# EAGLE design CCM_0005 (EAGLE 6.5.0)
Unipolar (6 wire) stepper motor driver
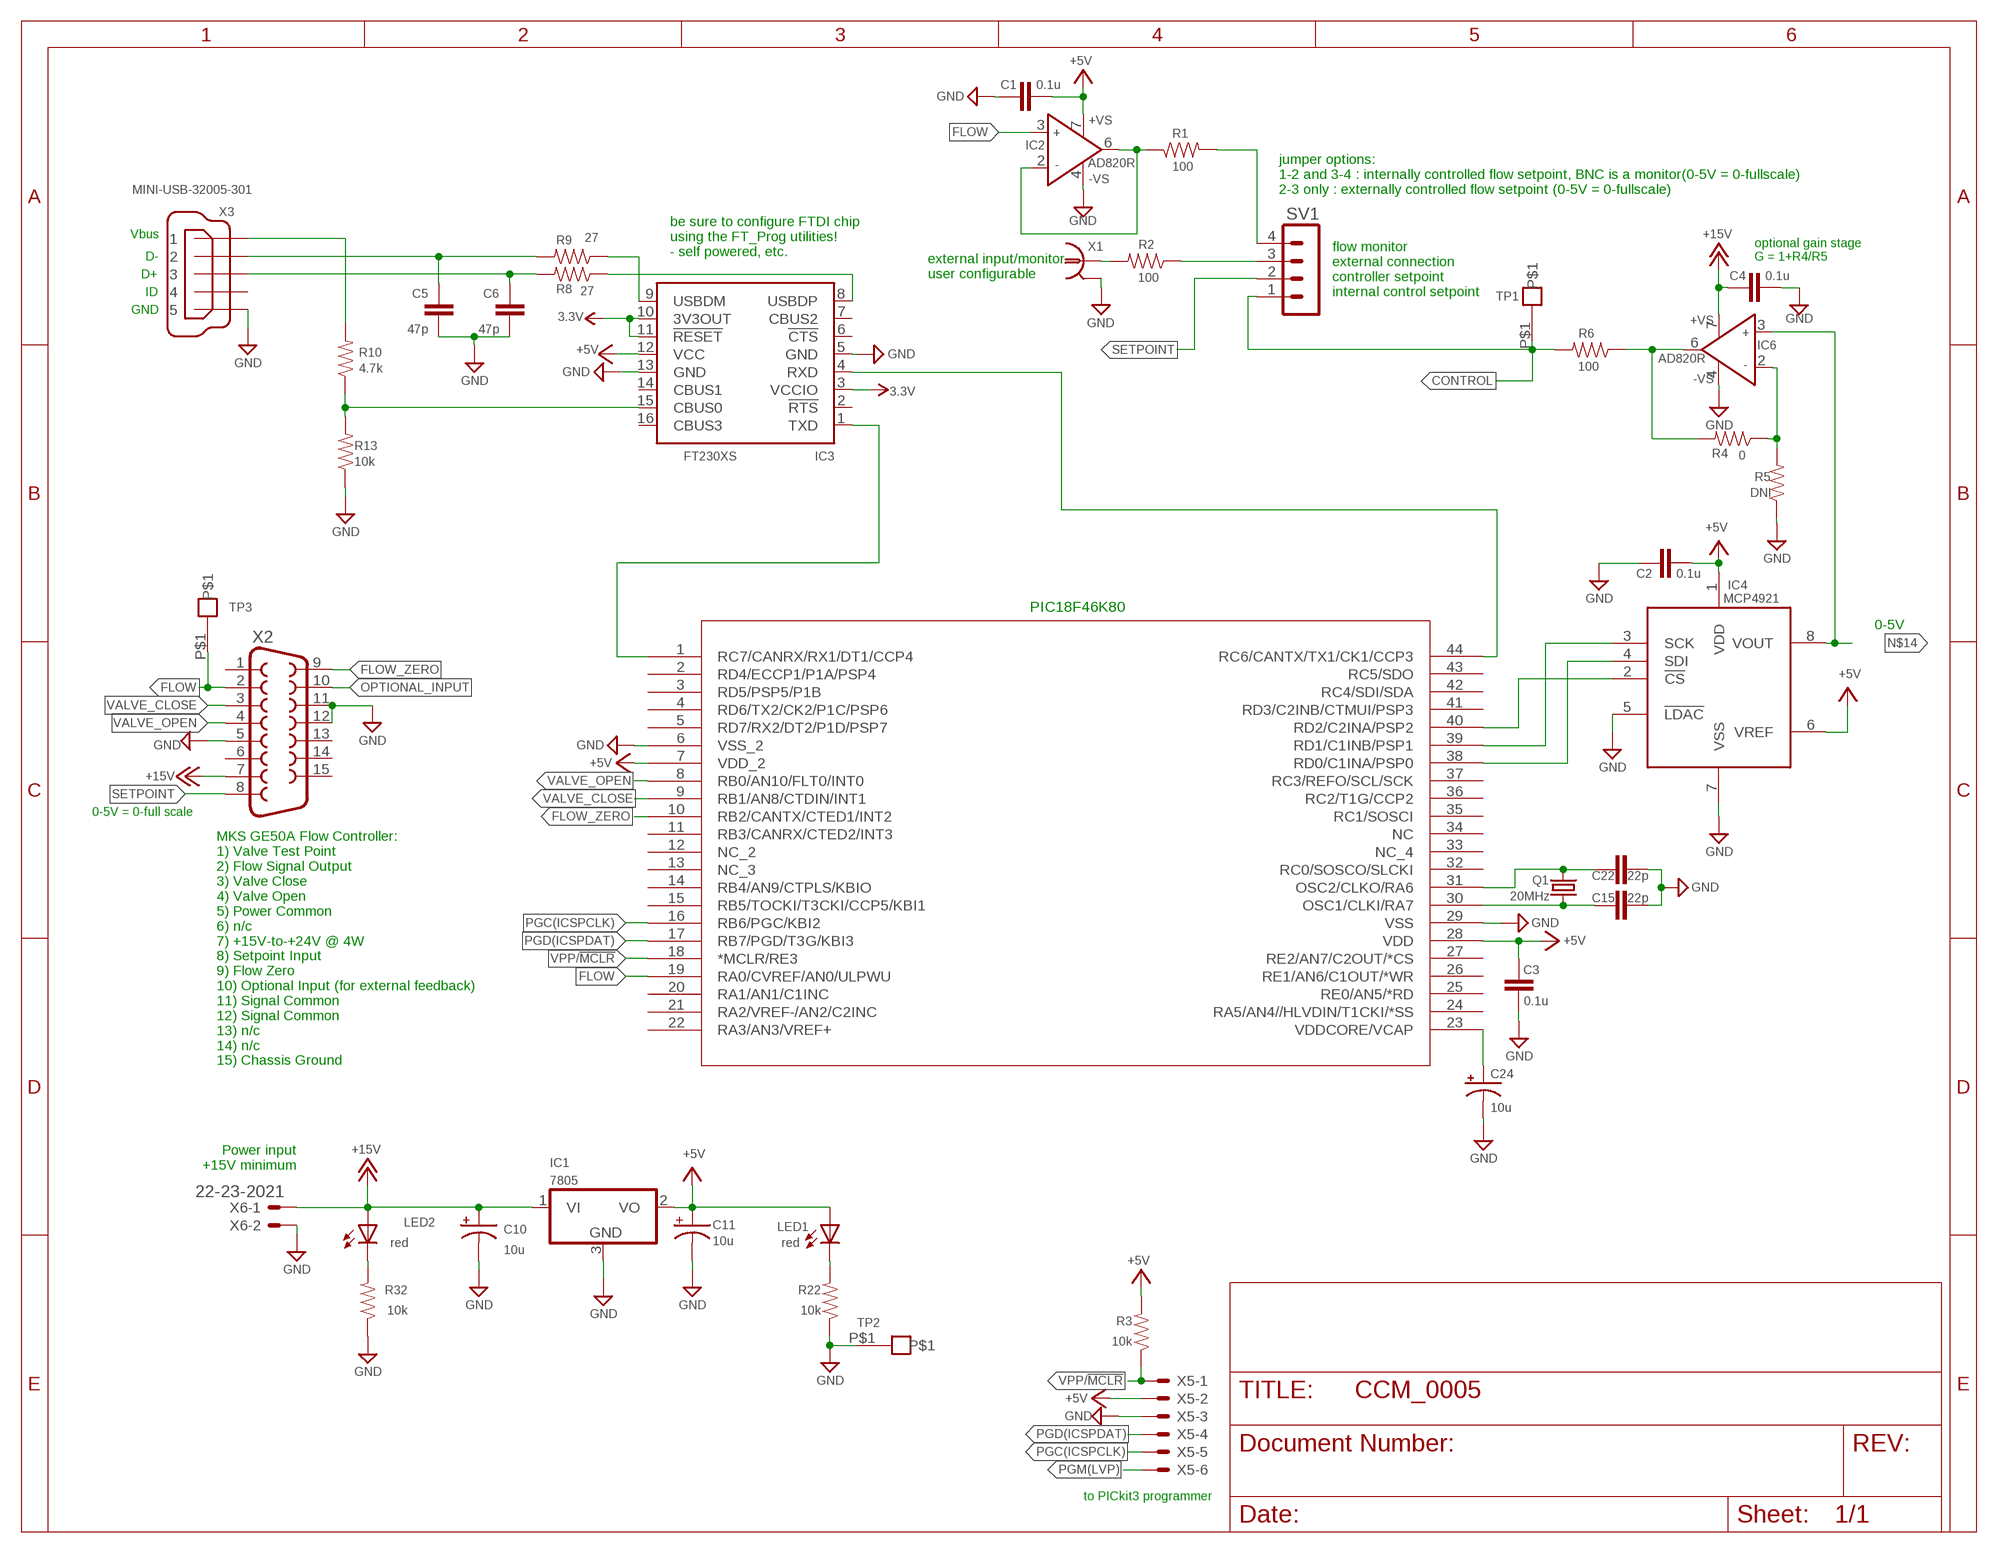
[diagram p0: schematic, sheet 1]

## Parts
C1  0.1u  CAP0603-CAP  [0603-CAP]
C2  0.1u  CAP0603-CAP  [0603-CAP]
C3  0.1u  CAP0603-CAP  [0603-CAP]
C4  0.1u  CAP0603-CAP  [0603-CAP]
C5  47p  CAP0603-CAP  [0603-CAP]
C6  47p  CAP0603-CAP  [0603-CAP]
C10  10u  CAP_POL1206  [EIA3216]
C11  10u  CAP_POL1206  [EIA3216]
C15  22p  CAP0603-CAP  [0603-CAP]
C22  22p  CAP0603-CAP  [0603-CAP]
C24  10u  CAP_POL1206  [EIA3216]
IC1  7805  7824DT  [TO252]
IC2  AD820R  [SO8]
IC3  FT230XS  [SSOP16]
IC4  MCP4921  [SO08]
IC5  PIC18F46K80  [TQFP44_MC]
IC6  AD820R  [SO8]
LED1  red  LEDCHIPLED_0603  [CHIPLED_0603]
LED2  red  LEDCHIPLED_0603  [CHIPLED_0603]
Q1  20MHz  CRYSTALTC26V  [TC26V]
R1  100  RESISTOR0603-RES  [0603-RES]
R2  100  RESISTOR0603-RES  [0603-RES]
R3  10k  RESISTOR0603-RES  [0603-RES]
R4  0  RESISTOR0603-RES  [0603-RES]
R5  DNI  RESISTOR0603-RES  [0603-RES]
R6  100  RESISTOR0603-RES  [0603-RES]
R8  27  RESISTOR0603-RES  [0603-RES]
R9  27  RESISTOR0603-RES  [0603-RES]
R10  4.7k  RESISTOR0603-RES  [0603-RES]
R13  10k  RESISTOR0603-RES  [0603-RES]
R22  10k  RESISTOR0603-RES  [0603-RES]
R32  10k  RESISTOR0603-RES  [0603-RES]
SV1  MA04-1  [MA04-1]
TP1  control  TESTPOINT  [TESTPOINT]
TP2  TESTPOINT  [TESTPOINT]
TP3  control  TESTPOINT  [TESTPOINT]
X1  1-227161-0  [AMP_227161]
X2  F15HP  [F15HP]
X3  MINI-USB-32005-301  [32005-301]
X5  22-23-2061  [22-23-2061]
X6  22-23-2021  [22-23-2021]

## Nets
3.3V: IC3.3(VCCIO) IC3.10(3V3OUT) IC3.11(!RESET)
+5V: C1.1 C2.1 C3.1 C11.A(+) IC1.2(VO) IC2.7(+VS) IC3.12(VCC) IC4.1(VDD) IC4.6(VREF) IC5.7(VDD_2) IC5.28(VDD) LED1.A R3.2 X5.2
+15V: C4.2 C10.A(+) IC1.1(VI) IC6.7(+VS) LED2.A X2.7 X6.1
CONTROL: R6.2 SV1.1 TP1.P$1
D+: C6.1 R8.2 X3.3
D-: C5.1 R9.2 X3.2
FLOW: IC2.3(IN+) IC5.19(RA0/CVREF/AN0/ULPWU) TP3.P$1 X2.2
FLOW_ZERO: IC5.10(RB2/CANTX/CTED1/INT2) X2.9
GND: C1.2 C2.2 C3.2 C4.1 C5.2 C6.2 C10.C(-) C11.C(-) C15.1 C22.1 C24.C(-) IC1.3(GND) IC2.4(-VS) IC3.5(GND) IC3.13(GND) IC4.5(!LDAC) IC4.7(VSS) IC5.6(VSS_2) IC5.29(VSS) IC6.4(-VS) R5.1 R13.1 R22.1 R32.1 TP2.P$1 X1.2 X2.5 X2.11 X2.12 X3.5 X5.3 X6.2
LED1: LED1.C R22.2
LED5: LED2.C R32.2
N12: IC6.6(OUT) R4.2 R6.1
N$1: R2.2 X1.1
N$2: R1.2 SV1.4
N$3: IC2.2(IN-) IC2.6(OUT) R1.1
N$4: C15.2 IC5.30(OSC1/CLKI/RA7) Q1.1
N$5: IC3.1(TXD) IC5.1(RC7/CANRX/RX1/DT1/CCP4)
N$6: IC3.9(USBDM) R9.1
N$7: IC4.2(!CS) IC5.40(RD2/C2INA/PSP2)
N$8: IC3.8(USBDP) R8.1
N$9: R2.1 SV1.3
N$10: C22.2 IC5.31(OSC2/CLKO/RA6) Q1.2
N$11: IC4.3(SCK) IC5.39(RD1/C1INB/PSP1)
N$12: C24.A(+) IC5.23(VDDCORE/VCAP)
N$13: IC3.15(CBUS0) R10.1 R13.2
N$14: IC4.8(VOUT) IC6.3(IN+)
N$15: IC6.2(IN-) R4.1 R5.2
N$16: IC4.4(SDI) IC5.38(RD0/C1INA/PSP0)
OPTIONAL_INPUT: X2.10
PGC(ICSPCLK): IC5.16(RB6/PGC/KBI2) X5.5
PGD(ICSPDAT): IC5.17(RB7/PGD/T3G/KBI3) X5.4
PGM(LVP): X5.6
SETPOINT: SV1.2 X2.8
TX1: IC3.4(RXD) IC5.44(RC6/CANTX/TX1/CK1/CCP3)
VALVE_CLOSE: IC5.9(RB1/AN8/CTDIN/INT1) X2.3
VALVE_OPEN: IC5.8(RB0/AN10/FLT0/INT0) X2.4
VBUS: R10.2 X3.1
VPP/!MCLR: IC5.18(*MCLR/RE3) R3.1 X5.1
Unconnected: IC3.2(!RTS) IC3.6(!CTS) IC3.7(CBUS2) IC3.14(CBUS1) IC3.16(CBUS3) IC5.2(RD4/ECCP1/P1A/PSP4) IC5.3(RD5/PSP5/P1B) IC5.4(RD6/TX2/CK2/P1C/PSP6) IC5.5(RD7/RX2/DT2/P1D/PSP7) IC5.11(RB3/CANRX/CTED2/INT3) IC5.12(NC_2) IC5.13(NC_3) IC5.14(RB4/AN9/CTPLS/KBIO) IC5.15(RB5/TOCKI/T3CKI/CCP5/KBI1) IC5.20(RA1/AN1/C1INC) IC5.21(RA2/VREF-/AN2/C2INC) IC5.22(RA3/AN3/VREF+) IC5.24(RA5/AN4//HLVDIN/T1CKI/*SS) IC5.25(RE0/AN5/*RD) IC5.26(RE1/AN6/C1OUT/*WR) IC5.27(RE2/AN7/C2OUT/*CS) IC5.32(RC0/SOSCO/SLCKI) IC5.33(NC_4) IC5.34(NC) IC5.35(RC1/SOSCI) IC5.36(RC2/T1G/CCP2) IC5.37(RC3/REFO/SCL/SCK) IC5.41(RD3/C2INB/CTMUI/PSP3) IC5.42(RC4/SDI/SDA) IC5.43(RC5/SDO) X2.1 X2.6 X2.13 X2.14 X2.15 X3.4

## Notes on the sheet
- jumper options:
  1-2 and 3-4 : internally controlled flow setpoint, BNC is a monitor(0-5V = 0-fullscale)
  2-3 only : externally controlled flow setpoint (0-5V = 0-fullscale)
- Vbus
- be sure to configure FTDI chip
  using the FT_Prog utilities!
  - self powered, etc.
- D-
- optional gain stage
  G = 1+R4/R5
- D+
- external input/monitor
  user configurable
- ID
- flow monitor
  external connection
  controller setpoint
  internal control setpoint
- GND
- PIC18F46K80
- 0-5V
- 0-5V = 0-full scale
- MKS GE50A Flow Controller:
  1) Valve Test Point
  2) Flow Signal Output
  3) Valve Close
  4) Valve Open
  5) Power Common
  6) n/c
  7) +15V-to-+24V @ 4W
  8) Setpoint Input
  9) Flow Zero
  10) Optional Input (for external feedback)
  11) Signal Common
  12) Signal Common
  13) n/c
  14) n/c
  15) Chassis Ground
- Power input
  +15V minimum
- to PICkit3 programmer

## Library data of the parts
C1-C6 C15 C22 = SparkFun:CAP: Capacitor Standard 0603 ceramic capacitor, and 0.1" leaded capacitor.
C10 C11 C24 = SparkFun:CAP_POL: Capacitor Polarized These are standard SMD and PTH capacitors. Normally 10uF, 47uF, and 100uF in electrolytic and tantalum varieties. Always verify the external diameter of the through hole cap, it varies with capacity, voltage, and manufacturer. The EIA devices should be standard.
IC1 = linear:78*: Positive VOLTAGE REGULATOR Source: http://cache.national.com/ds/LM/LM78L05.pdf http://www.fairchildsemi.com/ds/LM/LM7805.pdf
IC2 IC6 = analog-devices:AD820: Single-Supply, Rail-to-Rail, Low Power, FET Input Op Amp Source: http://www.analog.com/static/imported-files/data_sheets/AD820.pdf; OC_FARNELL: 1838867; OC_NEWARK: unknown
IC3 = ftdichip:FT230X: USB to BASIC UART IC Auto generated by make-symbol-device-package-bsdl.ulp Rev. 43 Source: Data sheet <http://www.ftdichip.com/Support/Documents/DataSheets/ICs/DS_FT230X.pdf>
IC4 = ic:MCP4921
IC5 = Fitch:PIC18F46K80
LED1 LED2 = led:LED: LED OSRAM: - CHIPLED LG R971, LG N971, LY N971, LG Q971, LY Q971, LO R971, LY R971 LH N974, LH R974 LS Q976, LO Q976, LY Q976 LO Q996 - Hyper CHIPLED LW Q18S LB Q993, LB Q99A, LB R99A - SideLED LS A670, LO A670, LY A670, LG A670, LP A670 LB A673, LV A673, LT A673, LW A673 LH A674 LY A675 LS A676, LA A676, LO A676, LY A676, LW A676 LS A679, LY A679, LG A679 - Hyper Micro SIDELED® LS Y876, LA Y876, LO Y876, LY Y876 LT Y87S - SmartLED LW L88C, LW L88S LB L89C, LB L89S, LG L890 LS L89K, LO L89K, LY L89K LS L896, LA L896, LO L896, LY L896 - TOPLED LS T670, LO T670, LY T670, LG T670, LP T670 LSG T670, LSP T670, LSY T670, LOP T670, LYG T670 LG T671, LOG T671, LSG T671 LB T673, LV T673, LT T673, LW T673 LH T674 LS T676, LA T676, LO T676, LY T676, LB T676, LH T676, LSB T676, LW T676 LB T67C, LV T67C, LT T67C, LS T67K, LO T67K, LY T67K, LW E67C LS E67B, LA E67B, LO E67B, LY E67B, LB E67C, LV E67C, LT E67C LW T67C LS T679, LY T679, LG T679 LS T770, LO T770, LY T770, LG T770, LP T770 LB T773, LV T773, LT T773, LW T773 LH T774 LS E675, LA E675, LY E675, LS T675 LS T776, LA T776, LO T776, LY T776, LB T776 LHGB T686 LT T68C, LB T68C - Hyper Mini TOPLED® LB M676 - Mini TOPLED Santana® LG M470 LS M47K, LO M47K, LY M47K Source: http://www.osram.convergy.de LUXEON: - LUMILED® LXK2-PW12-R00, LXK2-PW12-S00, LXK2-PW14-U00, LXK2-PW14-V00 LXK2-PM12-R00, LXK2-PM12-S00, LXK2-PM14-U00 LXK2-PE12-Q00, LXK2-PE12-R00, LXK2-PE12-S00, LXK2-PE14-T00, LXK2-PE14-U00 LXK2-PB12-K00, LXK2-PB12-L00, LXK2-PB12-M00, LXK2-PB14-N00, LXK2-PB14-P00, LXK2-PB14-Q00 LXK2-PR12-L00, LXK2-PR12-M00, LXK2-PR14-Q00, LXK2-PR14-R00 LXK2-PD12-Q00, LXK2-PD12-R00, LXK2-PD12-S00 LXK2-PH12-R00, LXK2-PH12-S00 LXK2-PL12-P00, LXK2-PL12-Q00, LXK2-PL12-R00 Source: www.luxeon.com KINGBRIGHT: KA-3528ASYC Source: www.kingbright.com
Q1 = crystal:CRYSTAL: CRYSTAL
R1-R6 R8-R10 R13 R22 R32 = SparkFun:RESISTOR: Resistor Basic schematic elements and footprints for 0603, 1206, and PTH 1/10th watt (small) resistors.
SV1 = con-lstb:MA04-1: PIN HEADER; OC_FARNELL: unknown; OC_NEWARK: unknown
TP1-TP3 = Fitch:TESTPOINT
X1 = con-coax:?227161*: JACK, RIGHT ANGLE, 50 OHM, PCB, BNC Source: amp_227161.pdf; MF: TYCO ELECTRONICS; MPN: 1-227161; OC_FARNELL: unknown; OC_NEWARK: 33B3200
X2 = con-subd:F15: SUB-D; OC_FARNELL: unknown; OC_NEWARK: unknown
X3 = con-cypressindustries:MINI-USB-: MINI USB-B Conector Source: www.cypressindustries.com; OC_FARNELL: unknown; OC_NEWARK: unknown
X5 = con-molex:22-23-2061: .100" (2.54mm) Center Header - 6 Pin; MF: MOLEX; MPN: 22-23-2061; OC_FARNELL: 1462922; OC_NEWARK: 27C1933
X6 = con-molex:22-23-2021: .100" (2.54mm) Center Header - 2 Pin; MF: MOLEX; MPN: 22-23-2021; OC_FARNELL: 1462926; OC_NEWARK: 25C3832

## Net classes
1 standard: width 0.61 mm, clearance 0.254 mm

## Board
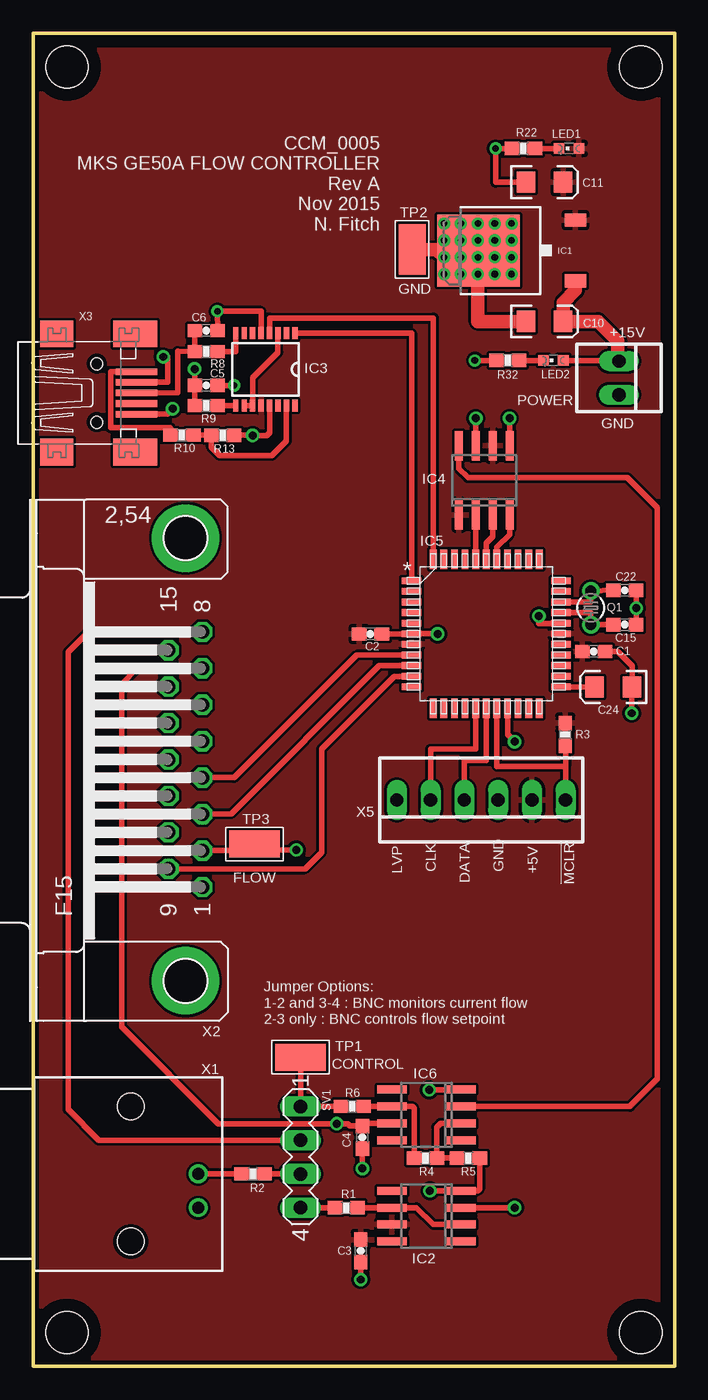
[diagram p1: board, top side]
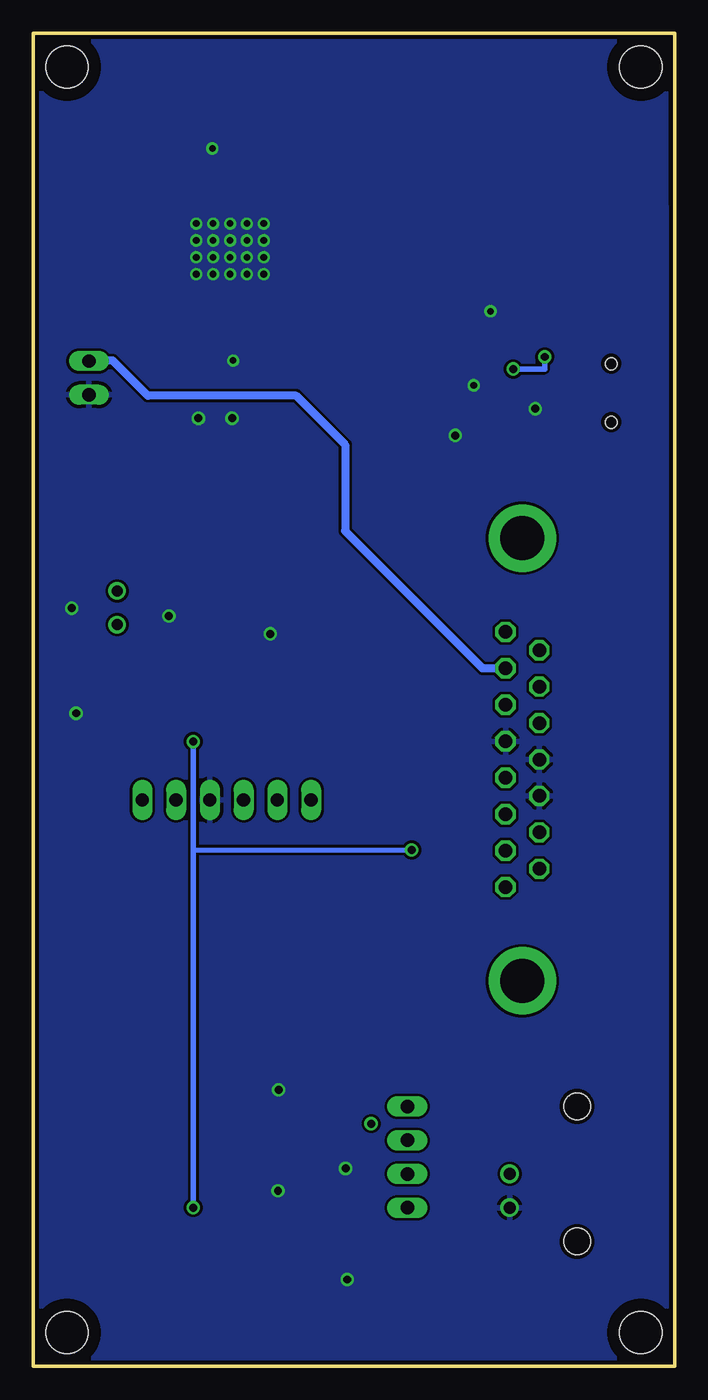
[diagram p2: board, bottom side, seen from below]

Size 48.26 x 100.33 mm. Coordinates in mm from the lower left corner, seen from the top.
Outline: 0,0 48.26,0 48.26,100.33 0,100.33 0,0
Copper layers (1*16): Top 0.035mm / dielectric 2mm / Bottom 0.035mm
Design rules "default *": minimum track width 10mil, minimum drill 19mil, track to track 8mil, track to pad 8mil, pad to pad 8mil, via to via 8mil, smd to smd 8mil, copper to edge 12mil, drill to drill 8mil, minimum pad ring 10mil, minimum via ring 8mil, stop-mask expansion 4mil, vias tented up to drill 0mil, thermal gap 10mil
Holes 3.2 mm at 2.54,2.54 2.54,97.79 45.72,97.79 45.72,2.54
tRestrict: area 44.4,1.3 to 47,3.8; area 1.3,1.3 to 3.8,3.8; area 1.3,96.5 to 3.8,99.1; area 44.4,96.5 to 47,99.1
bRestrict: area 1.3,96.5 to 3.8,99.1; area 44.4,96.5 to 47,99.1; area 44.4,1.3 to 47,3.8; area 1.3,1.3 to 3.8,3.8

### Footprints (pad centres in the part's own frame; a part is rotated, then mirrored left to right if it is on the bottom)
0603-CAP = smd 1.1 x 1: 1 -0.85,0; 2 0.85,0
EIA3216 = smd 1.4 x 1.6: A 1.4,0; C -1.4,0
TO252 = smd 1 x 1.6: 1 -2.28,-4.8; 2 2.28,-4.8 | smd 5.4 x 6.2: 3 0,2.5
SO8 = smd 0.6 x 2.2: 1 -1.905,-2.6; 2 -0.635,-2.6; 3 0.635,-2.6; 4 1.905,-2.6; 5 1.905,2.6; 6 0.635,2.6; 7 -0.635,2.6; 8 -1.905,2.6
SSOP16 = smd 0.914 x 0.406: 1 -2.718,2.223; 2 -2.718,1.587; 3 -2.718,0.953; 4 -2.718,0.318; 5 -2.718,-0.318; 6 -2.718,-0.953; 7 -2.718,-1.587; 8 -2.718,-2.223; 9 2.718,-2.223; 10 2.718,-1.587; 11 2.718,-0.953; 12 2.718,-0.318; 13 2.718,0.318; 14 2.718,0.953; 15 2.718,1.587; 16 2.718,2.223
SO08 = smd 0.6 x 2.2: 1 -1.905,-2.6; 2 -0.635,-2.6; 3 0.635,-2.6; 4 1.905,-2.6; 5 1.905,2.6; 6 0.635,2.6; 7 -0.635,2.6; 8 -1.905,2.6
TQFP44_MC = smd 1.473 x 0.508: 1 -5.613,3.988; 2 -5.613,3.2; 3 -5.613,2.388; 4 -5.613,1.6; 5 -5.613,0.787; 6 -5.613,0; 7 -5.613,-0.787; 8 -5.613,-1.6; 9 -5.613,-2.388; 10 -5.613,-3.2; 11 -5.613,-3.988; 23 5.613,-3.988; 24 5.613,-3.2; 25 5.613,-2.388; 26 5.613,-1.6; 27 5.613,-0.787; 28 5.613,0; 29 5.613,0.787; 30 5.613,1.6; 31 5.613,2.388; 32 5.613,3.2; 33 5.613,3.988 | smd 0.508 x 1.473: 12 -3.988,-5.613; 13 -3.2,-5.613; 14 -2.388,-5.613; 15 -1.6,-5.613; 16 -0.787,-5.613; 17 0,-5.613; 18 0.787,-5.613; 19 1.6,-5.613; 20 2.388,-5.613; 21 3.2,-5.613; 22 3.988,-5.613; 34 3.988,5.613; 35 3.2,5.613; 36 2.388,5.613; 37 1.6,5.613; 38 0.787,5.613; 39 0,5.613; 40 -0.787,5.613; 41 -1.6,5.613; 42 -2.388,5.613; 43 -3.2,5.613; 44 -3.988,5.613
CHIPLED_0603 = smd 0.8 x 0.8: A 0,-0.75; C 0,0.75
TC26V = drill 0.813: 1 -1.27,0; 2 1.27,0
0603-RES = smd 1.1 x 1: 1 -0.85,0; 2 0.85,0
MA04-1 = drill 1.016 long: 1 -3.81,0; 2 -1.27,0; 3 1.27,0; 4 3.81,0
TESTPOINT = smd 3.81 x 2.032: P$1 0,0
AMP_227161 = drill 0.9 pad 1.27: 1 0,-5.08; 2 -2.54,-5.08 | hole 2: -5.08,0; 5.08,0
F15HP = drill 1.016 octagon: 1 -9.601,-1.27; 2 -6.858,-1.27; 3 -4.115,-1.27; 4 -1.372,-1.27; 5 1.372,-1.27; 6 4.115,-1.27; 7 6.858,-1.27; 8 9.601,-1.27; 9 -8.23,1.27; 10 -5.486,1.27; 11 -2.743,1.27; 12 0,1.27; 13 2.743,1.27; 14 5.486,1.27; 15 8.23,1.27 | drill 3.302 pad 5.08: G1 -16.662,0; G2 16.662,0
32005-301 = smd 3.1 x 0.5: 1 3,1.6; 2 3,0.8; 3 3,0; 4 3,-0.8; 5 3,-1.6 | smd 2.5 x 2: M1 -3,-4.45; M2 -3,4.45 | smd 3.3 x 2: M3 2.9,4.45; M4 2.9,-4.45 | hole 0.9: 0,2.2; 0,-2.2
22-23-2061 = drill 1 long: 1 -6.35,0; 2 -3.81,0; 3 -1.27,0; 4 1.27,0; 5 3.81,0; 6 6.35,0
22-23-2021 = drill 1 long: 1 -1.27,0; 2 1.27,0

### Placement (x,y rotation side)
C1  42.16,53.8 0 top
C2  25.37,55.12 0 top
C3  24.64,8.69 270 top
C4  24.77,17.22 90 top
C5  13.02,73.83 0 top
C6  13.02,77.95 0 top
C10  38.47,78.64 0 top
C11  38.47,89.12 0 top
C15  44.51,55.82 180 top
C22  44.51,58.41 180 top
C24  43.64,51.13 180 top
IC1  35.99,83.97 90 top
IC2  29.59,11.3 90 top
IC3  17.46,75.03 270 top
IC4  33.93,66.67 0 top
IC5  34.09,55.13 0 top
IC6  29.59,18.92 90 top
LED1  40.31,91.66 90 top
LED2  39.13,75.7 90 top
Q1  41.95,57.09 90 top
R1  23.55,11.94 180 top
R2  16.54,14.48 180 top
R3  40.03,47.55 90 top
R4  29.51,15.67 180 top
R5  32.74,15.67 180 top
R6  24,19.56 180 top
R8  13.02,76.37 180 top
R9  13.02,72.3 180 top
R10  11.19,70.08 180 top
R13  14.26,70.07 180 top
R22  36.88,91.66 0 top
R32  35.7,75.7 0 top
SV1  20.12,15.75 270 top
TP1  20.12,23.27 0 top
TP2  28.5,84.05 90 top
TP3  16.64,39.29 0 top
X1  7.34,14.48 90 top
X2  11.46,45.67 90 top
X3  4.78,73.25 0 top
X5  33.71,42.62 180 top
X6  44.07,74.38 270 top

### Tracks (layer width: path | path; a pad name or v marks a point on that pad's centre or on a via)
3.3V
  Top 0.406: IC3.10 IC3.11 | IC3.11 16.19,72.31 16.19,72.3 | IC3.11 16.51,74.4 18.41,76.3 IC3.3
+5V
  pour Top: 0.51,99.06 46.99,99.06 46.99,0.51 0.51,0.51
+15V  (via drill 0.6)
  Top 0.406: LED2.A 44.02,75.7 X6.1 | C4.2 24.77,18.21 24.84,18.29 IC6.7 | 24.73,18.11 C4.2 | C4.2 24.75,18.09 23.82,18.09 23.65,18.26 v22.84,18.26 13.92,18.26 6.66,25.53 6.66,51.36 7.8,52.5 7.8,52.53 X2.7
  Top 1.016: IC1.1 40.79,80.97 39.88,80.06 C10.A 42.49,78.64 43.99,77.14 43.99,75.73 X6.1
  Bottom 0.61: X2.7 14.45,52.53 24.79,62.87 24.79,69.37 28.47,73.05 39.64,73.05 42.29,75.7 44.02,75.7 X6.1 44.08,75.67
CONTROL
  Top 0.406: TP1.P$1 SV1.1 R6.2
D+
  Top 0.406: C6.1 R8.2 10.87,76.4 10.87,73.28 X3.3
D-  (via drill 0.6)
  Top 0.406: R9.2 C5.1 12.14,73.83 v12.14,75.06 | v9.78,75.97 10.11,75.97 10.11,74.07 7.78,74.07 X3.2
  Bottom 0.406: v12.14,75.06 9.78,75.06 v9.78,75.97
FLOW  (via drill 0.6)
  Top 0.406: X2.2 16.64,38.81 TP3.P$1 16.94,39.29 17.37,38.86 v19.79,38.86 | IC5.19 35.69,47.55 v36.22,47.02 | v36.22,11.94 IC2.3
  Bottom 0.406: v36.22,47.02 36.22,38.96 | 36.22,38.96 v36.22,11.94 | v19.79,38.86 36.09,38.84 36.22,38.96
FLOW_ZERO
  Top 0.406: IC5.10 27.16,51.93 21.97,46.74 21.69,46.46 21.69,38.68 20.45,37.44 X2.9
GND  (via drill 0.5, 0.6)
  Top 0.406: C5.2 v15.11,73.83 | C6.2 v13.86,79.4 17.14,79.4 IC3.5 | R22.1 v34.78,91.66 34.78,89.12 C11.C | R32.1 v33.22,75.7 | C22.1 C15.1 45.36,55.79 v45.36,57.06 | IC5.29 38.05,55.92 v38.05,56.46 | v30.43,55.12 30.45,55.13 IC5.6 28.46,55.12 C2.2 | v45.03,49.15 C24.C 45.06,51.15 45.06,52.7 43.97,53.8 C1.2 | X3.5 10.08,71.65 v10.49,72.06 | R13.1 16.5,70.07 v16.51,70.05 17.55,70.05 17.78,70.28 IC3.13 | C3.2 v24.64,6.53 | v29.84,13.21 IC2.4 33.43,13.21 33.59,13.37 R5.1 | C4.1 v24.77,14.88 | IC6.4 32.17,20.8 v29.79,20.8 | IC4.5 v35.84,71.35 | IC4.7 v33.3,71.35
  Top 1.016: C10.C 33.45,78.64 v33.45,82.19 v33.45,83.46 33.45,83.97 IC1.3 | TP2.P$1 30.33,84.05 v30.91,83.46
  other vias: 35.99,86 35.99,84.73 35.99,83.46 35.99,82.19 34.72,86 34.72,84.73 34.72,83.46 34.72,82.19 33.45,84.73 33.45,86 32.18,86 32.18,84.73 32.18,83.46 32.18,82.19 30.91,86 30.91,84.73 30.91,82.19
  pour Bottom: 0.66,99.8 47.75,99.77 47.75,0.51 0.51,0.51
LED1
  Top 0.406: R22.2 LED1.C
LED5
  Top 0.406: LED2.C R32.2
N12
  Top 0.406: R6.1 IC6.6 28.5,19.56 28.65,19.41 28.65,15.69 R4.2
N$1
  Top 0.406: R2.2 X1.1
N$2
  Top 0.406: R1.2 SV1.4
N$3
  Top 0.406: R1.1 IC2.6 28.83,11.94 30.1,10.67 IC2.2
N$4
  Top 0.406: C15.2 Q1.1 41.95,56.73 IC5.30
N$5
  Top 0.406: IC3.1 28.47,77.75 IC5.1
N$6
  Top 0.406: IC3.9 R9.1
N$7
  Top 0.406: IC4.2 IC5.40
N$8
  Top 0.406: IC3.8 15.24,76.36 R8.1
N$9
  Top 0.406: R2.1 SV1.3
N$10
  Top 0.406: C22.2 Q1.2 41.95,57.52 IC5.31
N$11
  Top 0.406: IC5.39 34.09,61.98 34.57,62.46 IC4.3
N$12
  Top 0.406: IC5.23 42.24,51.14 C24.A
N$13
  Top 0.406: R10.1 R13.2 13.41,69.16 14.02,68.56 17.96,68.56 19.05,69.65 IC3.15
N$14
  Top 0.406: IC6.3 44.88,19.56 46.97,21.64 46.97,64.62 44.7,66.88 32.72,66.88 32.03,67.56 IC4.8
N$15
  Top 0.406: R5.2 R4.1 30.35,15.68 30.35,17.98 30.66,18.29 IC6.2
N$16
  Top 0.406: IC5.38 34.87,61.65 35.84,62.61 IC4.4
PGC(ICSPCLK)
  Top 0.406: X5.5 29.9,46.46 33.3,46.46 IC5.16
PGD(ICSPDAT)
  Top 0.406: X5.4 32.44,45.59 34.09,45.59 IC5.17
SETPOINT
  Top 0.406: SV1.2 4.93,17.02 2.62,19.33 2.62,53.75 4.14,55.27 X2.8
TX1
  Top 0.406: IC3.4 17.78,78.89 30.1,78.89 IC5.44
VALVE_CLOSE
  Top 0.406: IC5.9 26.05,52.74 14.88,41.58 12.75,41.58 X2.3
VALVE_OPEN
  Top 0.406: IC5.8 24.35,53.53 15.11,44.3 X2.4
VBUS
  Top 0.406: X3.1 | X3.1 5.82,74.85 5.82,70.64 10.31,70.64 10.34,70.59 R10.2
VPP/!MCLR
  Top 0.406: X5.1 40.06,45.16 | 40.06,45.16 34.87,45.16 IC5.18 | R3.1 40.06,46.7 40.06,45.16

### Text on the board
tNames: CCM_0005 / MKS GE50A FLOW CONTROLLER / Rev A / Nov 2015 / N. Fitch | GND | +15V | POWER | GND | FLOW | LVP | CLK | GND | +5V | DATA | !MCLR! | Jumper Options: / 1-2 and 3-4 : BNC monitors current flow / 2-3 only : BNC controls flow setpoint | CONTROL
tValues: PROG